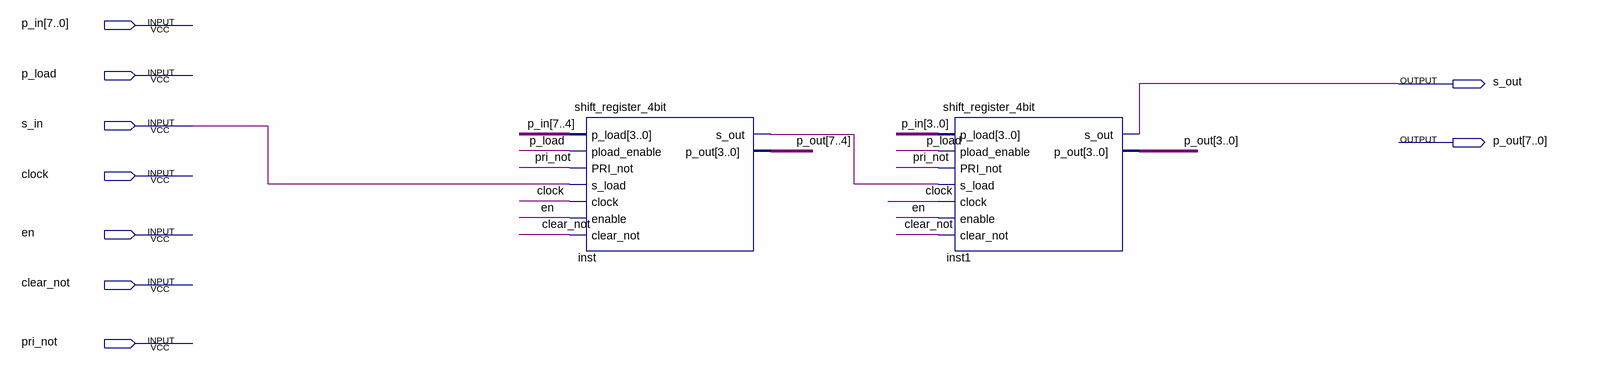
[diagram p0: schematic sheet]
// Quartus schematic register_8bit.bdf as structural Verilog: 2 symbols, 9 pins
module register_8bit (
  input  [7:0] p_in,
  input  p_load,
  input  s_in,
  input  clock,
  input  en,
  input  clear_not,
  input  pri_not,
  output s_out,
  output [7:0] p_out
);

  wire inst_s_out;

  shift_register_4bit inst (
    .p_load(p_in[7:4]), .pload_enable(p_load), .PRI_not(pri_not), .s_load(s_in), .clock(clock), .enable(en),
    .clear_not(clear_not), .s_out(inst_s_out), .p_out(p_out[7:4]));
  shift_register_4bit inst1 (
    .p_load(p_in[3:0]), .pload_enable(p_load), .PRI_not(pri_not), .s_load(inst_s_out), .clock(clock),
    .enable(en), .clear_not(clear_not), .s_out(s_out), .p_out(p_out[3:0]));
endmodule
